# EasyEDA Pro project AD9833_DDS信号发生器.eprj

# Schematic Schematic1
Board Name: Board1; Create Date: 2025-02-17; Page Name: P1; Project Name: AD9833_DDS信号发生器; Schematic Name: Schematic1; Update Date: 2025-02-18; Company: 嘉立创EDA; Page Size: A4; Version: V1.0
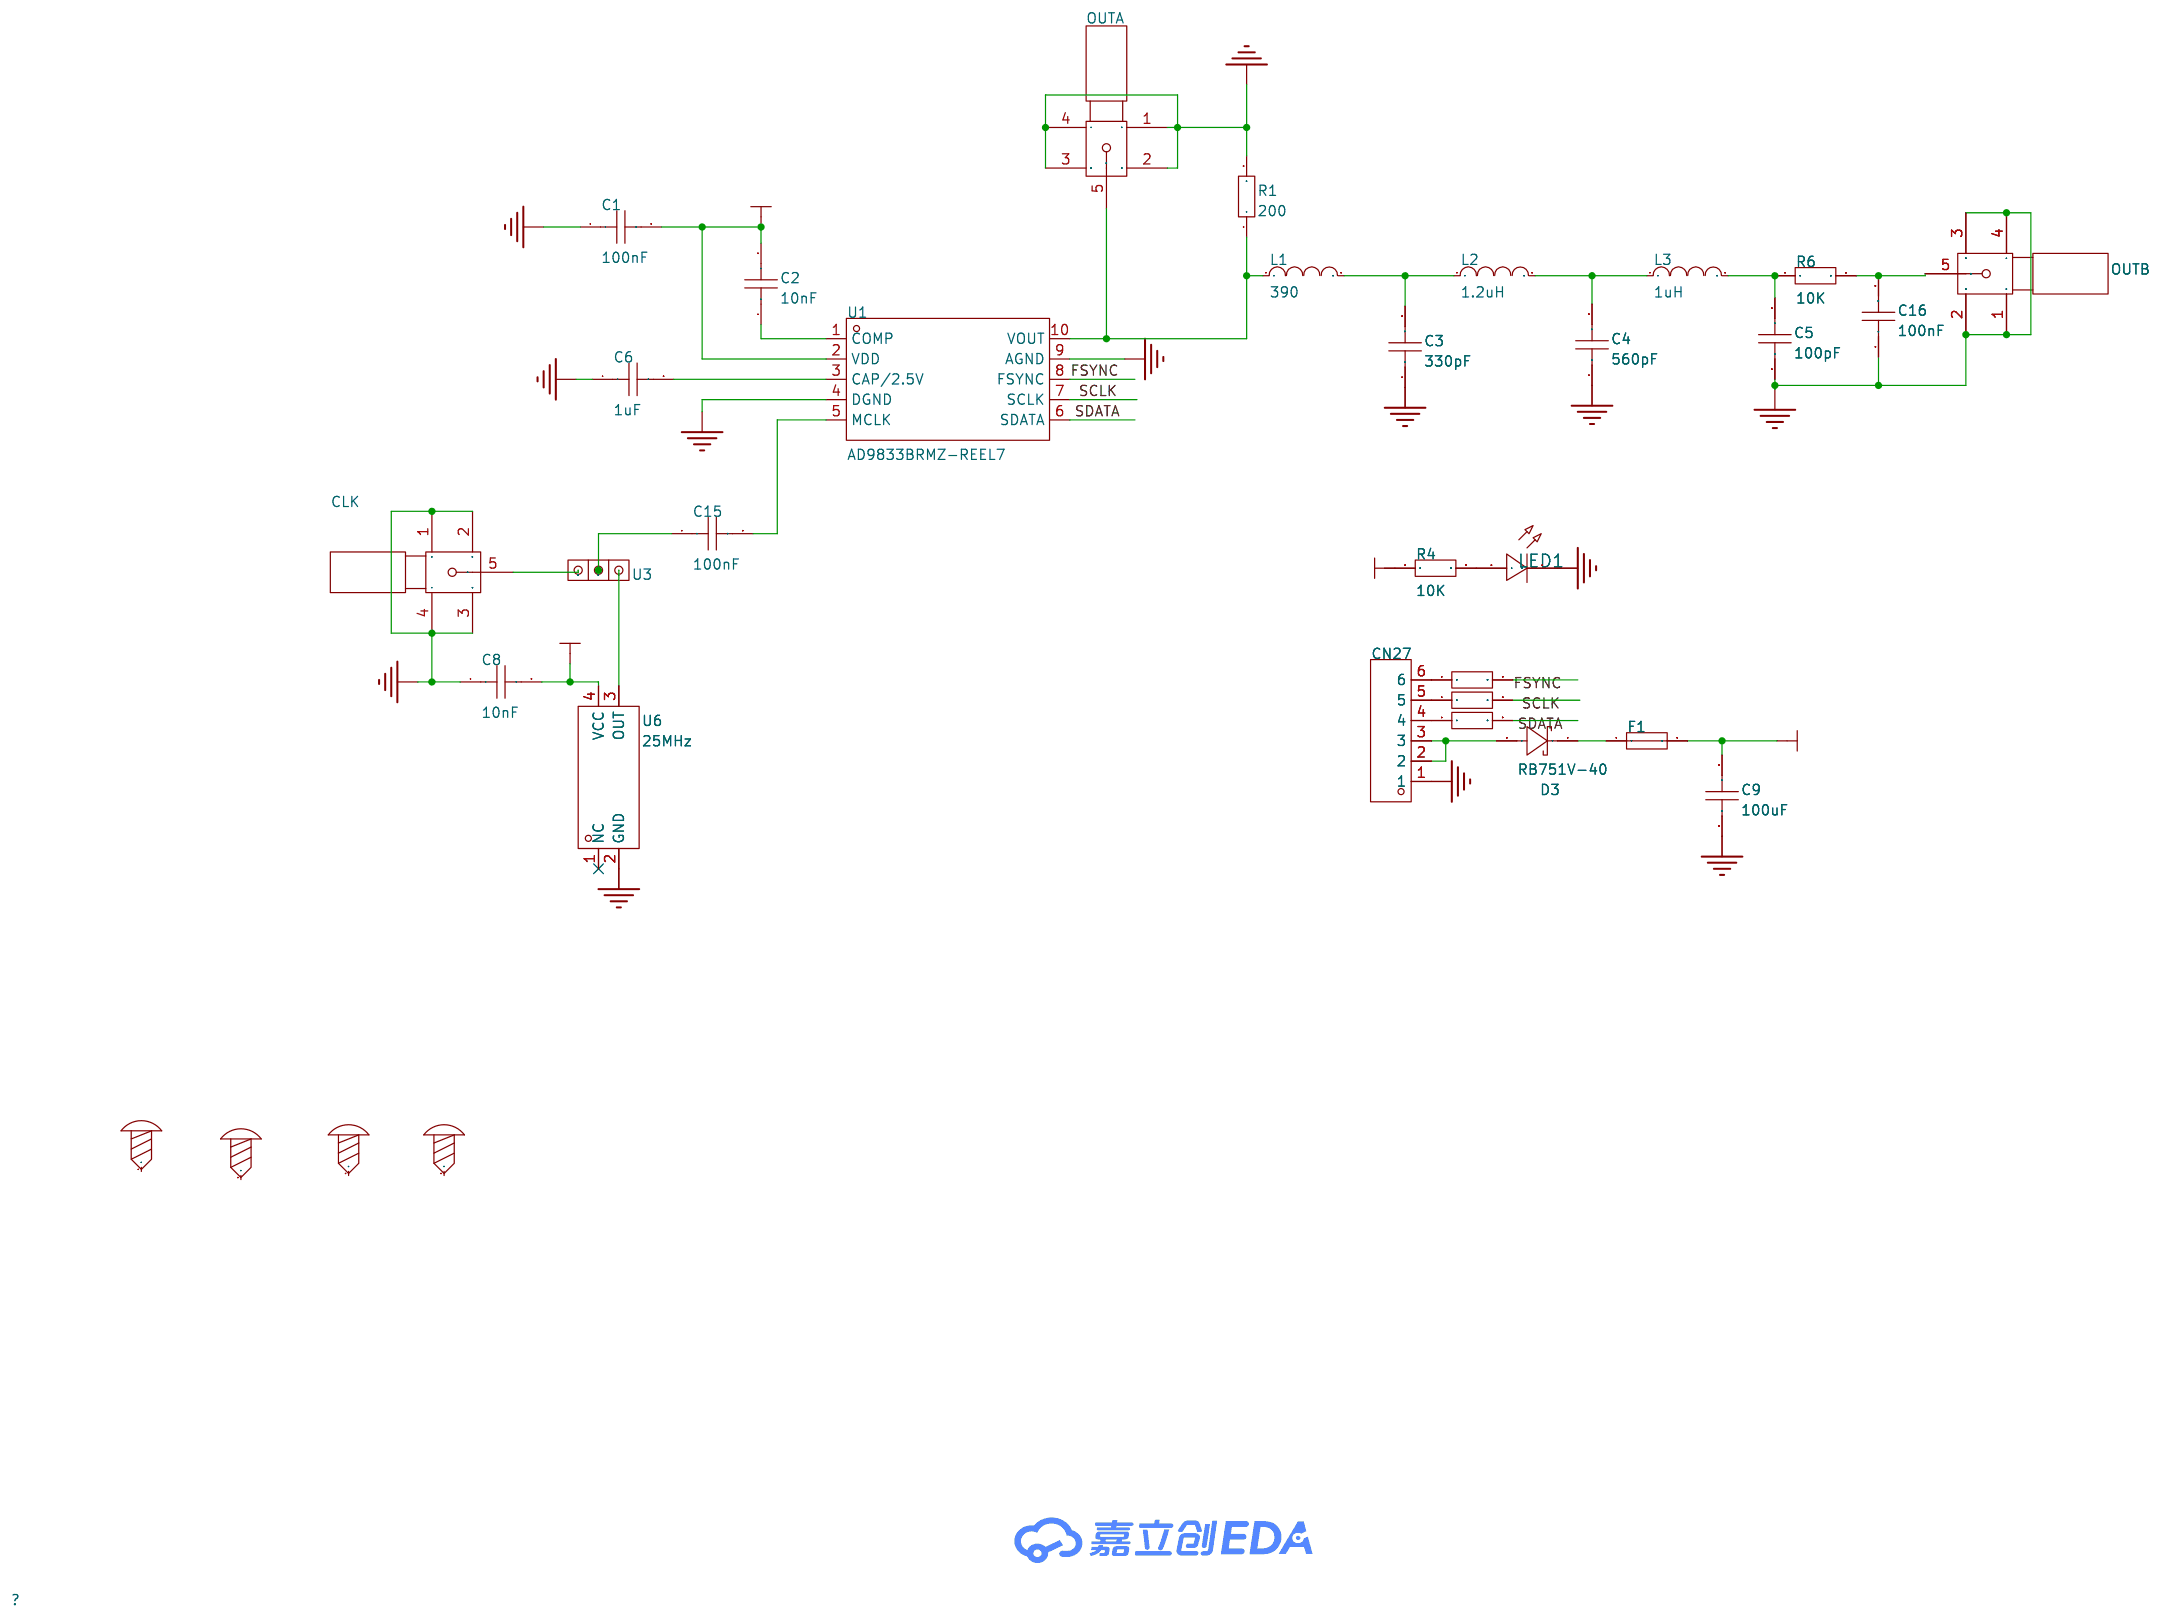
[diagram p0: schematic sheet]

## Parts
C1  100nF  [R0805]
C2  10nF  [R0805]
C3  330pF  [R0805]
C4  560pF  [R0805]
C5  100pF  [R0805]
C6  1uF  [R0805]
C8  10nF  [R0805]
C9  100uF  [C1210]
C15  100nF  [R0805]
C16  100nF  [R0805]
CLK  -  [SMA]
CN27  XH2.54*6P_直插  [CONN-TH_XH2.54-6P]
D3  RB751V-40  [SOD-323_L1.7-W1.3-LS2.6-RD-1]
F1  BSMD0805-003-30V  [F0805]
L1  390  [R0805]
L2  1.2uH  [R0805]
L3  1uH  [R0805]
LED1  -  [LED_0805]
OUTA  -  [SMA]
OUTB  -  [SMA]
R1  200  [R0805]
R2  10K  [R0805]
R3  10K  [R0805]
R4  10K  [R0805]
R5  10K  [R0805]
R6  10K  [R0805]
SCREW1  -  [M3螺丝]
SCREW2  -  [M3螺丝]
SCREW3  -  [M3螺丝]
SCREW4  -  [M3螺丝]
U1  AD9833BRMZ-REEL7  [MSOP-10_L3.0-W3.0-P0.50-LS5.0-BL]
U3  -  [1*3跳线]
U6  25MHz  [OSC-SMD_4P-L7.0-W5.0-BL]

## Library data of the parts
C1-C6 C8 C15 C16 = CAP_0805: Supplier Footprint: 0805
C9 = GRM32ER60J107ME20L: LCSC Part Name: 100uF ±20% 6.3V; Supplier Part: C88154; Manufacturer: muRata(村田); Supplier Footprint: 1210; JLCPCB Part Class: Extended Part; Datasheet: https://atta.szlcsc.com/upload/public/pdf/source/20170116/1484561244372.pdf; Supplier: LCSC; Tolerance: ±20%; Voltage Rated: 6.3V; Temperature Coefficient: X5R
CLK OUTA OUTB = SMA
CN27 = XH2.54*6P_直插: Supplier Part: C9900008614; Supplier Footprint: XH2.54_6P; JLCPCB Part Class: 扩展库; Supplier: LCSC
D3 = RB751V-40_C7502691: LCSC Part Name: 电压:40V 电流:30mA; Supplier Part: C7502691; Manufacturer: 宏迦橙; Supplier Footprint: SOD-323; JLCPCB Part Class: 扩展库; Datasheet: https://atta.szlcsc.com/upload/public/pdf/source/20230828/92E6C0C5321000DDFDA2BB61EC3C00B5.pdf; Supplier: LCSC; Diode Configuration: 独立式; Forward Voltage (Vf@If): 370mV@1mA; Reverse Voltage (Vr): 40V; Average Rectified Current (Io): 30mA; Reverse Leakage Current (Ir): 500nA; Peak forward surge current: 200mA
F1 = BSMD0805-003-30V: LCSC Part Name: 30V 0.03A 0805自恢复; Supplier Part: C7500482; Manufacturer: BHFUSE(佰宏); Supplier Footprint: 0805; JLCPCB Part Class: 扩展库; Datasheet: https://atta.szlcsc.com/upload/public/pdf/source/20231116/3005D3C33E08BDEA0FB53F4180A72F5D.pdf; Supplier: LCSC; Operating Voltage (Max): 30V; Current Rating (Max): 20A; Hold Current: 30mA; Trip Current: 90mA; Power Dissipation: 500mW; Resistance - Initial (Ri) (Min): 6Ω; Resistance - Post Trip (R1) (Max): 50Ω; Maximum Time to Trip: 1s; Operating Temperature: -40℃~+85℃
L1-L3 = L_0805: Supplier Footprint: L0805
LED1 = LED_0805-R: Supplier Footprint: 0805
R1-R6 = Res_0805: Supplier Footprint: 0805
SCREW1-SCREW4 = M3螺丝: Supplier Footprint: 插件
U1 = AD9833BRMZ-REEL7_C9652: LCSC Part Name: AD9833低功耗DDS设备; Supplier Part: C9652; Manufacturer: ADI(亚德诺); Supplier Footprint: MSOP-10; JLCPCB Part Class: 扩展库; Datasheet: https://atta.szlcsc.com/upload/public/pdf/source/20121029/1457706544172.pdf; Supplier: LCSC; Supply Voltage: 2.3V~5.5V; Resolution (Bits): 10; Tuning  Word Width(Max): 28b; The main FCLK: 25MHz; Operating Temperature: -40℃~+85℃
U3 = 1*3跳线
U6 = CO75H4-25.000-33GDTST: LCSC Part Name: 25MHz 3.3V HCMOS +/-10PPM; Supplier Part: C2905361; Manufacturer: HCI(杭晶); Supplier Footprint: SMD7050-4P; JLCPCB Part Class: 扩展库; Datasheet: https://atta.szlcsc.com/upload/public/pdf/source/20220525/8A5D6CFF436A3D6FB5711C1D3D06A199.pdf; Supplier: LCSC; Output Type: HCMOS; Supply Voltage: 3.3V; Frequency Stability(Full temperature range): ±50ppm; Operating Temperature: -40℃~+85℃

## Nets
DVDD: C1.2 C2.2 C8.2 C9.2 F1.2 R4.1 U1.2(VDD) U6.4(VCC)
GND: C1.1 C3.1 C4.1 C5.1 C6.1 C8.1 C9.1 C16.1 CLK.1 CLK.2 CLK.3 CLK.4 CN27.1 LED1.1(C) OUTA.1 OUTA.2 OUTA.3 OUTA.4 OUTB.1 OUTB.2 OUTB.3 OUTB.4 R1.2 U1.4(DGND) U1.9(AGND) U6.2(GND)
FSYNC: R3.2 U1.8(FSYNC)
SCLK: R2.2 U1.7(SCLK)
SDATA: R5.2 U1.6(SDATA)
$1N573: C2.1 U1.1(COMP)
$1N663: C6.2 U1.3(CAP/2.5V)
$1N747: C15.2 U1.5(MCLK)
$1N1125: L1.1 OUTA.5 R1.1 U1.10(VOUT)
$1N1131: C3.2 L1.2 L2.1
$1N1136: C4.2 L2.2 L3.1
$1N1141: C5.2 L3.2 R6.1
$1N1560: LED1.2(A) R4.2
$1N2543: C15.1 U3.2
$1N2557: U3.1 U6.3(OUT)
$1N2562: CLK.5 U3.3
$1N3631: CN27.2 CN27.3 D3.2(A)
$1N3734: C16.2 OUTB.5 R6.2
$1N3934: D3.1(K) F1.1
$1N4057: CN27.6 R3.1
$1N4059: CN27.5 R2.1
$1N4061: CN27.4 R5.1

Not connected (* = marked no-connect by the designer): SCREW1 1; SCREW2 1; SCREW3 1; SCREW4 1; U6 1(NC)*

# Board PCB1
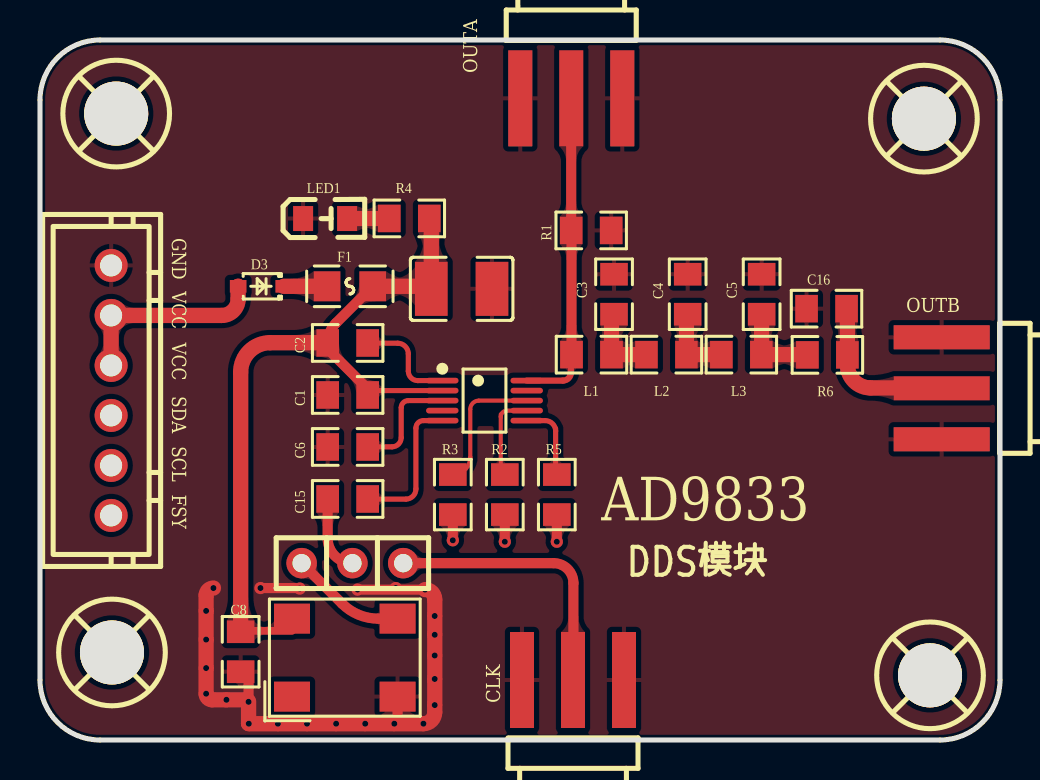
[diagram p1: board, top side]
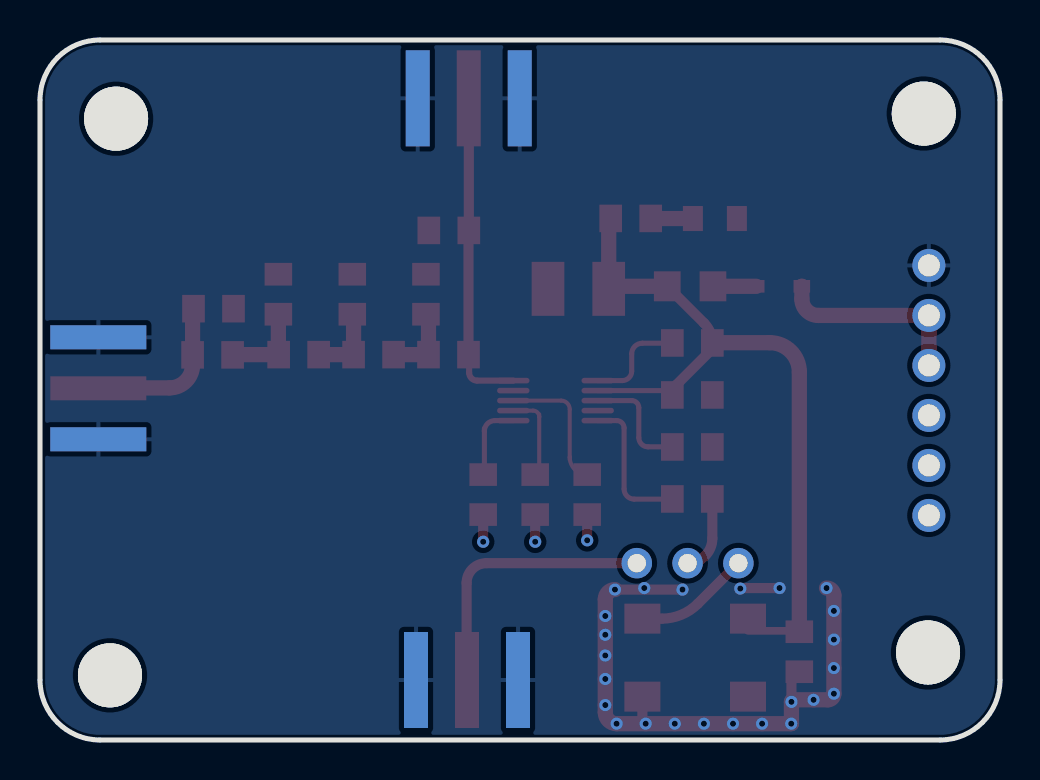
[diagram p2: board, bottom side, seen from below]

Outline 48 x 35 mm; copper layers: Top Layer, Bottom Layer. Coordinates in mm from the lower left corner of the outline.
Outline path: 0,32 0,3 arc(0.88,0.88) 3,0 45,0 arc(47.12,0.88) 48,3 48,32 arc(47.12,34.12) 45,35 3,35 arc(0.88,34.12) 0,32
Stack: Top Layer 0.035mm / Dielectric1 1.51mm FR4 er 4.5 / Bottom Layer 0.035mm

## Design rules (mm)
template: 自定义配置
spacing copperThickness1oz (default): track to track 0.102, other pairs 0.102 to 0.3
spacing copperThickness2oz: track to track 0.203, other pairs 0.152 to 0.3
track width copperThickness1oz (default): min 0.127, default 0.254, max 2.54
track width copperThickness2oz: min 0.203, default 0.254, max 2.54
differential pair differentialPair (default): width min 0.127, default 0.254, max 2.54; gap min 0.152, default 0.152
via viaSize (default): diameter min 0.5, default 0.61, max 10; hole min 0.3, default 0.305, max 6.299

## Placement (name value [footprint] x y rotation side)
C1  100nF  [R0805#2]  15.49 17.25 0 top
C2  10nF  [R0805#2]  15.27 19.85 180 top
C3  330pF  [R0805#2]  28.7 22.18 270 top
C4  560pF  [R0805#2]  32.39 22.18 270 top
C5  100pF  [R0805#2]  36.08 22.18 270 top
C6  1uF  [R0805#2]  15.49 14.65 0 top
C8  10nF  [R0805#2]  10.03 4.52 90 top
C9  100uF  [C1210]  21.08 22.56 180 top
C15  100nF  [R0805#2]  15.49 12.05 0 top
C16  100nF  [R0805#2]  39.44 21.57 0 top
CLK  -  [SMA]  32.51 -0.81 90 top
CN27  XH2.54*6P_直插  [CONN-TH_XH2.54-6P]  3.56 17.48 270 top
D3  RB751V-40  [SOD-323_L1.7-W1.3-LS2.6-RD-1]  11.05 22.69 180 top
F1  BSMD0805-003-30V  [F0805]  15.49 22.69 0 top
L1  390  [R0805#2]  27.69 19.27 0 top
L2  1.2uH  [R0805#2]  31.43 19.27 0 top
L3  1uH  [R0805#2]  35.18 19.27 0 top
LED1  -  [LED_0805]  14.31 26.07 0 top
OUTA  -  [SMA]  20.7 35.89 270 top
OUTB  -  [SMA]  48.89 23.45 180 top
R1  200  [R0805]  27.56 25.48 0 top
R2  10K  [R0805]  23.24 12.27 90 top
R3  10K  [R0805]  20.64 12.27 90 top
R4  10K  [R0805]  18.47 26.08 180 top
R5  10K  [R0805]  25.84 12.27 90 top
R6  10K  [R0805]  39.37 19.26 0 top
SCREW1  -  [M3螺丝]  44.5 3.23 0 top
SCREW2  -  [M3螺丝]  3.6 4.38 0 top
SCREW3  -  [M3螺丝]  3.81 31.32 0 top
SCREW4  -  [M3螺丝]  44.2 31.07 0 top
U1  AD9833BRMZ-REEL7  [MSOP-10_L3.0-W3.0-P0.50-LS5.0-BL]  22.23 16.97 270 top
U3  -  [1*3跳线]  18.16 8.84 90 top
U6  25MHz  [OSC-SMD_4P-L7.0-W5.0-BL]  15.24 4.12 0 top

## Footprints (pads in the part's own frame, mm; a bottom-side part is the same pattern mirrored in y, then rotated)
1*3跳线
  round 1.524 hole 0.914: 1(0,5.08) 2(0,2.54) 3(0,0)
C1210
  rect 1.635x2.7 smd: 1(-1.518,0) 2(1.518,0)
CONN-TH_XH2.54-6P
  round 1.65 hole 1.1: 1(-6.25,0) 2(-3.75,0) 3(-1.25,0) 4(1.25,0) 5(3.75,0) 6(6.25,0)
F0805
  rect 1.335x1.5 smd: 1(-1.143,0) 2(1.143,0)
LED_0805
  rect 1x1.25 smd: 1(-1.15,0.005) 2(1.05,0.005)
M3螺丝
  round 3.2 hole 3.2: 1(0,0)
MSOP-10_L3.0-W3.0-P0.50-LS5.0-BL
  oval 0.28x1.62 smd: 1(-1,-2.11) 2(-0.5,-2.11) 3(0,-2.11) 4(0.5,-2.11) 5(1,-2.11) 6(1,2.11) 7(0.5,2.11) 8(0,2.11) 9(-0.5,2.11) 10(-1,2.11)
OSC-SMD_4P-L7.0-W5.0-BL
  rect 1.8x1.5 smd: 1(-2.64,-1.95) 2(2.64,-1.95) 3(2.64,1.95) 4(-2.64,1.95)
R0805
  rect 1.133x1.377 smd: 1(-1,0) 2(1,0)
R0805#2
  rect 1.133x1.377 smd: 1(-1.111,0) 2(0.889,0)
SMA
  rect 4.8x1.2 smd: 1(3.81,8.412) 2(3.81,3.312) 5(3.81,5.862)
  rect 4.8x1.2 smd far side: 3(3.81,3.312) 4(3.81,8.412)
SOD-323_L1.7-W1.3-LS2.6-RD-1
  rect 0.83x0.63 smd: 1(-1.14,0) 2(1.14,0)

## Nets
As in the schematic.

Pads without a net: SCREW1 1; SCREW2 1; SCREW3 1; SCREW4 1; U6 1

## Via types
v1: diameter 0.61, hole 0.305, Top Layer to Bottom Layer, 27 vias

## Routing (per net, layer and track width the routed paths; a pad name or vN(x,y) marks a point on that pad's centre or on a via; arc(x,y) is an arc through that point)
DVDD: length 38.1
  Top Layer w0.254: U1.2 16.6,17.47 arc(16.45,17.41) C1.2
  Top Layer w0.381: 12.6,5.46 10.08,5.46
  Top Layer w0.508: 14.07,19.87 16.17,17.77 arc(16.33,17.53) C1.2 ; F1.2 14.79,20.84 arc(14.49,20.39) C2.2
  Top Layer w0.762: F1.2 19.44,22.69 arc(19.53,22.65) C9.2 19.56,25.98 arc(19.54,26.05) R4.1 ; C8.2 10.03,18.39 arc(10.46,19.43) 11.51,19.87 14.07,19.87
GND: length 33.3
  Top Layer w0.508: v1(11.02,7.6) 12.76,7.6 ; v1(10.43,1.91) 10.43,3.02 arc(10.31,3.3) C8.1 ; U6.2 17.88,0.98 arc(17.83,0.86) v1(17.72,0.82) ; v1(19.25,7.52) v1(15.88,7.52)
  Top Layer w0.762: v1(8.67,7.6) arc(8.41,7.49) 8.31,7.23 v1(8.31,6.45) v1(8.31,5.02) v1(8.31,3.6) v1(8.31,2.31) arc(8.4,2.1) 8.61,2.01 v1(9.32,2.01) 10.33,2.01 arc(10.4,1.98) v1(10.43,1.91) 10.43,0.83 arc(10.43,0.82) v1(10.44,0.82) v1(11.89,0.82) v1(13.35,0.82) v1(14.81,0.82) v1(16.26,0.82) v1(17.72,0.82) v1(19.17,0.82) arc(19.57,0.98) 19.74,1.38 v1(19.74,1.75) v1(19.74,3.05) v1(19.74,4.23) v1(19.74,5.26) v1(19.74,6.2) 19.74,7.04 arc(19.59,7.38) v1(19.25,7.52)
  vias: v1(12.99,7.57) v1(17.79,7.6)
FSYNC: length 7
  Top Layer w0.203: 21.51,14.14 21.51,14.02 ; 21.51,14.14 21.51,16.54 arc(21.64,16.84) 21.95,16.97 U1.8 ; 21.51,14.14 arc(21.26,13.53) R3.2
SCLK: length 4.6
  Top Layer w0.203: 23.04,16.28 23.04,16.16 ; 23.04,16.16 23.04,13.47 arc(23.1,13.33) R2.2 ; 23.04,16.16 arc(23.13,16.38) 23.35,16.47 23.65,16.47 arc(23.68,16.47) 23.71,16.47 U1.7
SDATA: length 4.1
  Top Layer w0.254: 25.78,15.45 25.78,13.33 arc(25.8,13.29) R5.2 ; 25.78,15.45 25.78,15.57 ; 25.78,15.45 arc(25.63,15.82) 25.26,15.97 U1.6
$1N573: length 5.2
  Top Layer w0.254: U1.1 18.89,17.97 arc(18.55,18.11) 18.42,18.44 18.42,19.31 arc(18.26,19.68) 17.88,19.84 16.39,19.84 arc(16.39,19.84) C2.1
$1N663: length 5.7
  Top Layer w0.254: U1.3 18.42,16.97 arc(18.16,16.87) 18.06,16.61 18.06,15.12 arc(17.93,14.79) 17.6,14.66 16.39,14.66 arc(16.38,14.66) C6.2
$1N747: length 7.3
  Top Layer w0.254: U1.5 19.17,15.97 arc(18.9,15.86) 18.8,15.6 18.8,12.55 arc(18.65,12.19) 18.29,12.04 16.39,12.04 arc(16.39,12.05) C15.2
$1N1125: length 16.2
  Top Layer w0.305: U1.10 26.15,17.97 arc(26.43,18.09) 26.54,18.37 26.54,19.24 arc(26.55,19.26) L1.1
  Top Layer w0.508: L1.1 26.58,25.46 arc(26.57,25.47) R1.1 26.56,32.08 arc(26.56,32.08) OUTA.5
$1N1131: length 3.8
  Top Layer w0.762: L2.1 L1.2 28.58,21.16 arc(28.61,21.25) C3.2
$1N1136: length 3.8
  Top Layer w0.762: 34.07,19.27 L2.2 32.32,21.22 arc(32.34,21.27) C4.2
$1N1141: length 4.3
  Top Layer w0.762: C5.2 36.08,19.28 arc(36.08,19.27) 36.07,19.27 38.36,19.27 arc(38.37,19.26) R6.1
$1N1560: length 2.1
  Top Layer w0.762: LED1.2 17.46,26.07 arc(17.46,26.07) R4.2
$1N2543: length 3.9
  Top Layer w0.508: C15.1 14.38,10.08 arc(14.75,9.2) U3.2
$1N2557: length 5.8
  Top Layer w0.508: U3.1 15.11,6.81 arc(15.94,6.26) 16.91,6.07 U6.3
$1N2562: length 13.9
  Top Layer w0.508: U3.3 25.68,8.84 arc(26.38,8.55) 26.67,7.85 26.67,3.02 arc(26.66,3.01) CLK.5
$1N3631: length 10
  Top Layer w0.762: CN27.3 CN27.2 9.08,21.23 arc(9.67,21.47) 9.91,22.05 9.91,22.68 arc(9.91,22.68) D3.2
$1N3734: length 8.2
  Top Layer w0.762: C16.2 arc(40.36,21.55) 40.37,21.52 R6.2 40.37,18.76 arc(40.71,17.94) 41.53,17.6 45.07,17.6 arc(45.08,17.6) OUTB.5
$1N3934: length 2.2
  Top Layer w0.762: D3.1 F1.1
$1N4057: length 1.3
  Top Layer w0.508: R3.1 v1(20.64,9.98)
$1N4059: length 1.3
  Top Layer w0.508: 23.24,11.2 v1(23.24,9.91)
$1N4061: length 1.3
  Top Layer w0.508: 25.84,11.2 v1(25.84,9.91)

## Copper pours and planes (outline as drawn; the poured copper is in the pictures)
GND on Top Layer: -8.03,43.69 77.77,43.69 77.77,-13.38 -8.03,-13.38
GND on Bottom Layer: -9.37,44.05 61.9,44.05 61.9,-10.36 -9.37,-10.36

Small or netless copper shapes (teardrops, artwork), in the pictures only: 67 on Top Layer

## Text on the board
Top Silkscreen Layer: GND | VCC | SCL | FSY | SDA | DDS模块 | AD9833
